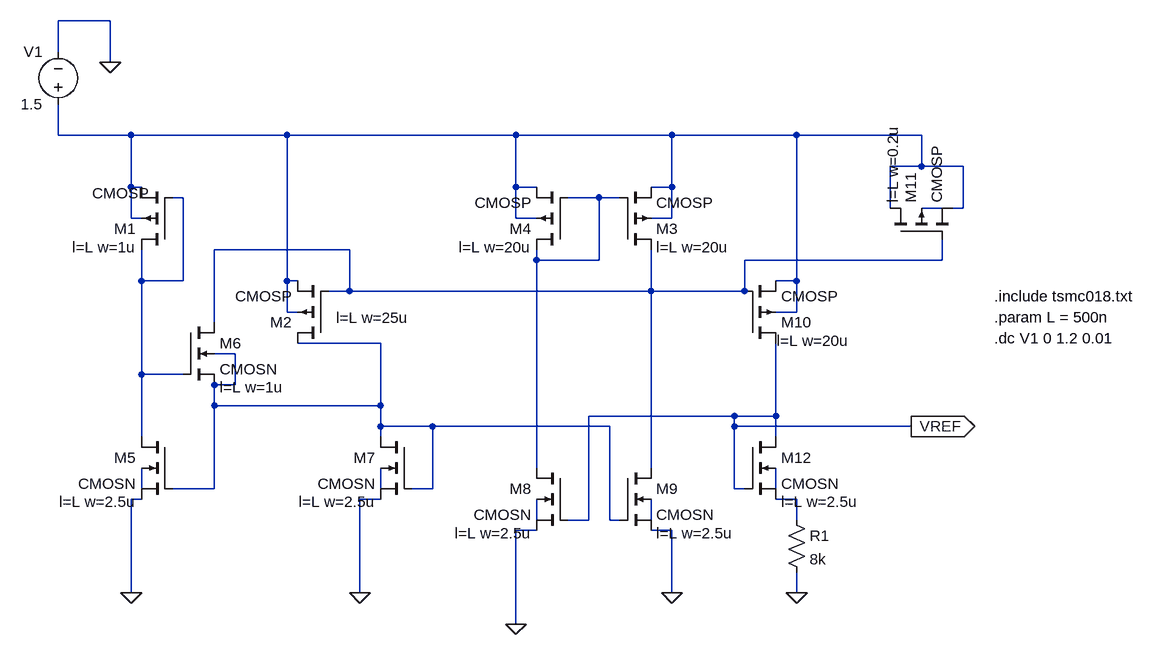
[diagram p0: schematic VoltageReference.asc]
VoltageReference.asc, the LTspice schematic file:
Version 4
SHEET 1 1928 680
WIRE -224 -320 -304 -320
WIRE -304 -272 -304 -320
WIRE -224 -256 -224 -320
WIRE -304 -144 -304 -192
WIRE -192 -144 -304 -144
WIRE 48 -144 -192 -144
WIRE 400 -144 48 -144
WIRE 640 -144 400 -144
WIRE 832 -144 640 -144
WIRE 1024 -144 832 -144
WIRE 1024 -96 1024 -144
WIRE 1024 -96 976 -96
WIRE 1088 -96 1024 -96
WIRE -192 -64 -192 -144
WIRE -176 -64 -192 -64
WIRE 400 -64 400 -144
WIRE 432 -64 400 -64
WIRE 640 -64 640 -144
WIRE 640 -64 608 -64
WIRE -112 -48 -128 -48
WIRE 528 -48 480 -48
WIRE 560 -48 528 -48
WIRE 976 -32 976 -96
WIRE 1056 -32 1024 -32
WIRE 1088 -32 1088 -96
WIRE 1088 -32 1072 -32
WIRE -192 -16 -192 -64
WIRE -176 -16 -192 -16
WIRE 400 -16 400 -64
WIRE 432 -16 400 -16
WIRE 640 -16 640 -64
WIRE 640 -16 608 -16
WIRE 144 32 -64 32
WIRE 432 48 432 32
WIRE 528 48 528 -48
WIRE 528 48 432 48
WIRE 1056 48 1056 16
WIRE 1056 48 752 48
WIRE -176 80 -176 32
WIRE -112 80 -112 -48
WIRE -112 80 -176 80
WIRE 48 80 48 -144
WIRE 64 80 48 80
WIRE 832 80 832 -144
WIRE 832 80 800 80
WIRE 144 96 144 32
WIRE 144 96 112 96
WIRE 608 96 608 32
WIRE 608 96 144 96
WIRE 752 96 752 48
WIRE 752 96 608 96
WIRE 48 128 48 80
WIRE 64 128 48 128
WIRE 832 128 832 80
WIRE 832 128 800 128
WIRE -64 144 -64 32
WIRE 192 176 64 176
WIRE -32 192 -64 192
WIRE -176 224 -176 80
WIRE -112 224 -176 224
WIRE -32 240 -32 192
WIRE -32 240 -64 240
WIRE -64 272 -64 240
WIRE 192 272 192 176
WIRE 192 272 -64 272
WIRE 736 288 512 288
WIRE 800 288 800 176
WIRE 800 288 736 288
WIRE 192 304 192 272
WIRE 272 304 192 304
WIRE 544 304 272 304
WIRE 736 304 736 288
WIRE 1008 304 736 304
WIRE -176 320 -176 224
WIRE 192 320 192 304
WIRE 800 320 800 288
WIRE 432 368 432 48
WIRE 608 368 608 96
WIRE -176 400 -176 368
WIRE -64 400 -64 272
WIRE -64 400 -128 400
WIRE 192 400 192 368
WIRE 272 400 272 304
WIRE 272 400 240 400
WIRE 736 400 736 304
WIRE 752 400 736 400
WIRE 800 400 800 368
WIRE -176 416 -192 416
WIRE 192 416 160 416
WIRE 832 416 800 416
WIRE 432 448 432 416
WIRE 512 448 512 288
WIRE 512 448 480 448
WIRE 544 448 544 304
WIRE 560 448 544 448
WIRE 608 448 608 416
WIRE 832 448 832 416
WIRE 432 464 400 464
WIRE 640 464 608 464
WIRE -192 560 -192 416
WIRE 160 560 160 416
WIRE 640 560 640 464
WIRE 832 560 832 528
WIRE 400 608 400 464
FLAG 400 608 0
FLAG 1008 304 VREF
IOPIN 1008 304 Out
FLAG -224 -256 0
FLAG 832 560 0
FLAG 640 560 0
FLAG 160 560 0
FLAG -192 560 0
SYMBOL pmos4 -128 32 R180
WINDOW 3 36 87 Left 2
WINDOW 123 56 4 Left 2
SYMATTR Value CMOSP
SYMATTR Value2 l=L w=1u
SYMATTR InstName M1
SYMBOL pmos4 112 176 R180
WINDOW 123 -123 39 Left 2
SYMATTR Value2 l=L w=25u
SYMATTR InstName M2
SYMATTR Value CMOSP
SYMBOL pmos4 480 32 R180
WINDOW 123 56 4 Left 2
SYMATTR Value2 l=L w=20u
SYMATTR InstName M4
SYMATTR Value CMOSP
SYMBOL pmos4 560 32 M180
WINDOW 123 56 4 Left 2
SYMATTR Value2 l=L w=20u
SYMATTR InstName M3
SYMATTR Value CMOSP
SYMBOL pmos4 752 176 M180
WINDOW 123 49 4 Left 2
SYMATTR Value2 l=L w=20u
SYMATTR InstName M10
SYMATTR Value CMOSP
SYMBOL pmos4 976 16 R270
WINDOW 123 56 4 Left 2
SYMATTR Value2 l=L w=0.2u
SYMATTR InstName M11
SYMATTR Value CMOSP
SYMBOL nmos4 -128 320 M0
WINDOW 123 56 100 Left 2
SYMATTR Value2 l=L w=2.5u
SYMATTR InstName M5
SYMATTR Value CMOSN
SYMBOL nmos4 -112 144 R0
WINDOW 123 56 100 Left 2
SYMATTR Value2 l=L w=1u
SYMATTR InstName M6
SYMATTR Value CMOSN
SYMBOL nmos4 240 320 M0
WINDOW 123 56 100 Left 2
SYMATTR Value2 l=L w=2.5u
SYMATTR InstName M7
SYMATTR Value CMOSN
SYMBOL nmos4 480 368 M0
WINDOW 123 56 100 Left 2
SYMATTR Value2 l=L w=2.5u
SYMATTR InstName M8
SYMATTR Value CMOSN
SYMBOL nmos4 560 368 R0
WINDOW 123 56 100 Left 2
SYMATTR Value2 l=L w=2.5u
SYMATTR InstName M9
SYMATTR Value CMOSN
SYMBOL nmos4 752 320 R0
WINDOW 123 56 100 Left 2
SYMATTR Value2 l=L w=2.5u
SYMATTR InstName M12
SYMATTR Value CMOSN
SYMBOL res 816 432 R0
SYMATTR InstName R1
SYMATTR Value 8k
SYMBOL voltage -304 -176 R180
WINDOW 0 24 96 Left 2
WINDOW 3 24 16 Left 2
WINDOW 123 0 0 Left 0
WINDOW 39 0 0 Left 0
SYMATTR InstName V1
SYMATTR Value 1.5
TEXT 1136 168 Left 2 !.dc V1 0 1.2 0.01
TEXT 1136 104 Left 2 !.include tsmc018.txt
TEXT 1136 136 Left 2 !.param L = 500n

The netlist it stands for:
* VoltageReference.asc
M1 N002 N002 N001 N001 CMOSP l=L w=1u
M2 N006 N005 N001 N001 CMOSP l=L w=25u
M4 N003 N003 N001 N001 CMOSP l=L w=20u
M3 N005 N003 N001 N001 CMOSP l=L w=20u
M10 VREF N005 N001 N001 CMOSP l=L w=20u
M11 N001 N005 N001 N004 CMOSP l=L w=0.2u
M5 N002 N006 0 N007 CMOSN l=L w=2.5u
M6 N005 N002 N006 N006 CMOSN l=L w=1u
M7 N006 N006 0 N008 CMOSN l=L w=2.5u
M8 N003 VREF 0 N011 CMOSN l=L w=2.5u
M9 N005 N006 0 N012 CMOSN l=L w=2.5u
M12 VREF VREF N010 N009 CMOSN l=L w=2.5u
R1 N010 0 8k
V1 N001 0 1.5
.model NMOS NMOS
.model PMOS PMOS
.lib standard.mos
.dc V1 0 1.2 0.01
.include tsmc018.txt
.param L = 500n
.backanno
.end